# EAGLE design mpx4115-breakout (EAGLE 6.5.0)
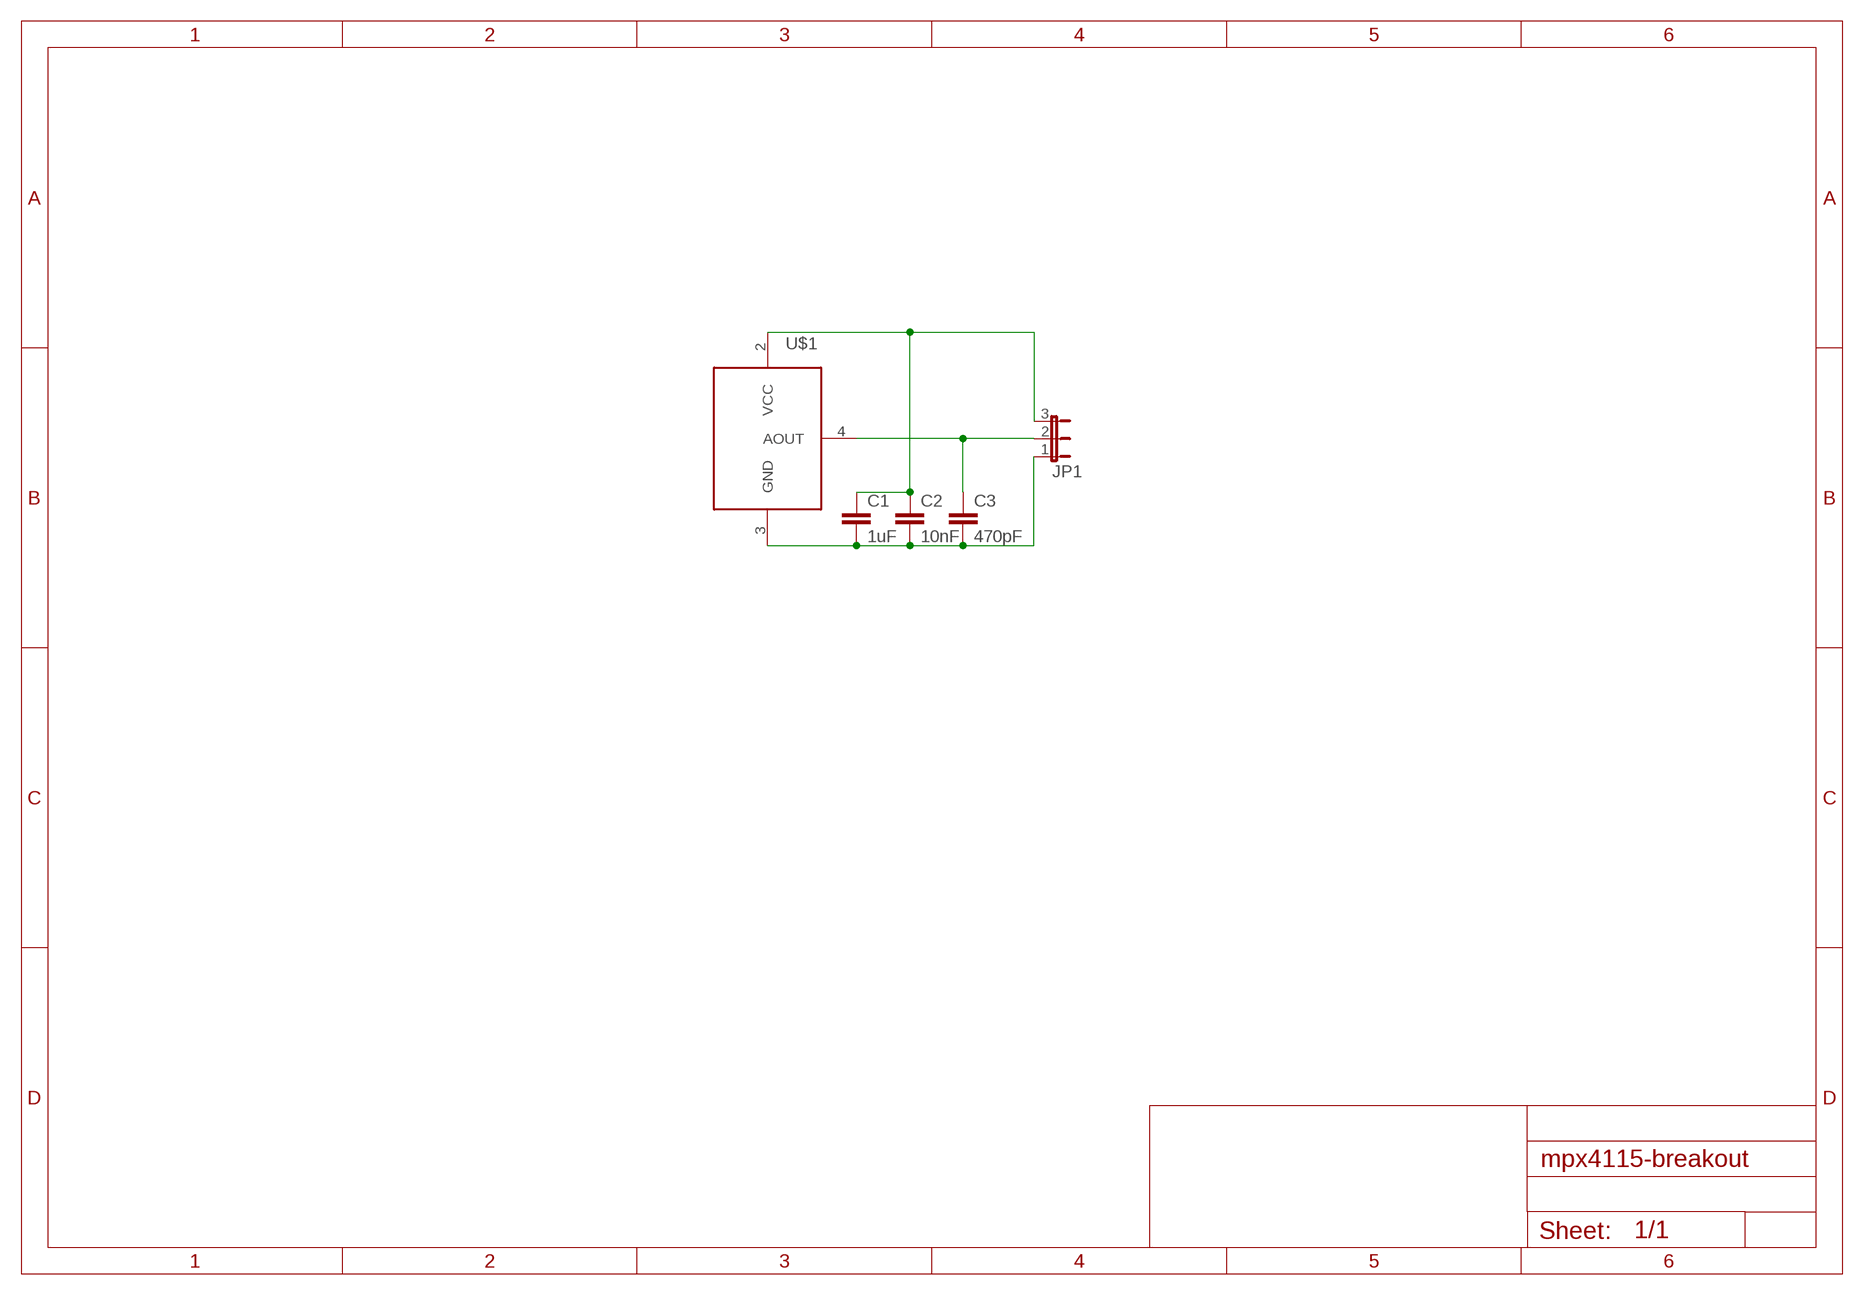
[diagram p0: schematic, sheet 1]

## Parts
C1  1uF  C-EUC0805  [C0805]
C2  10nF  C-EUC0805  [C0805]
C3  470pF  C-EUC0805  [C0805]
JP1  JP2E  [JP2]
U$1  MPX4115A  [MPX4115A]

## Nets
AOUT: C3.1 JP1.2 U$1.4(AOUT)
GND: C1.2 C2.2 C3.2 JP1.1 U$1.3(GND)
VCC: C1.1 C2.1 JP1.3 U$1.2(VCC)

## Library data of the parts
C1-C3 = resistor:C-EU: CAPACITOR, European symbol
JP1 = jumper:JP2E: JUMPER
U$1 = mountainsensing:MPX4115A

## Board
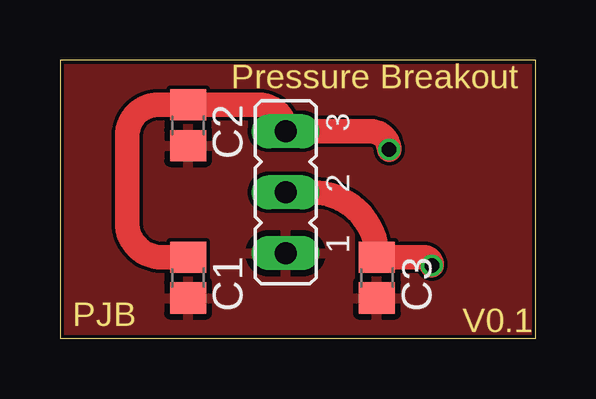
[diagram p1: board, top side]
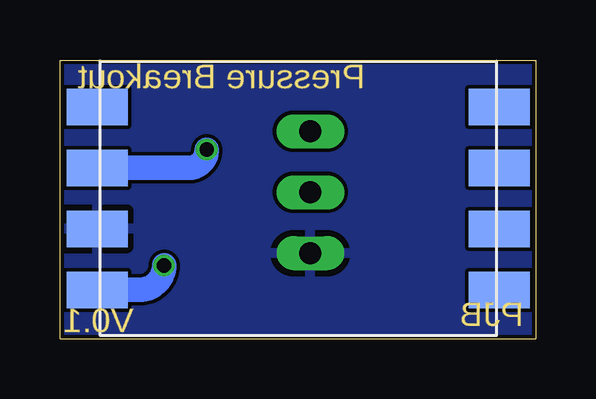
[diagram p2: board, bottom side, seen from below]

Size 19.83 x 11.61 mm. Coordinates in mm from the lower left corner, seen from the top.
Outline: 19.83,0 19.83,11.61 0,11.61 0,0 19.83,0
Copper layers (1*16): Top 0.035mm / dielectric 1.5mm / Bottom 0.035mm
Design rules "Hackvana": minimum track width 6mil, minimum drill 0.3mm, track to track 6mil, track to pad 6mil, pad to pad 6mil, via to via 6mil, smd to smd 0mil, copper to edge 6mil, drill to drill 6mil, minimum pad ring 10mil, minimum via ring 6mil, stop-mask expansion 2mil, vias tented up to drill 100mil, thermal gap 10mil

### Footprints (pad centres in the part's own frame; a part is rotated, then mirrored left to right if it is on the bottom)
C0805 = smd 1.3 x 1.5: 1 -0.85,0; 2 0.85,0
JP2 = drill 0.914 long: 1 -2.54,0; 2 0,0; 3 2.54,0
MPX4115A = smd 2.54 x 1.524: 1 -8.128,4.572; 2 -8.128,2.032; 3 -8.128,-0.508; 4 -8.128,-3.048; 5 8.636,4.572; 6 8.636,2.032; 7 8.636,-0.508; 8 8.636,-3.048

### Placement (x,y rotation side)
C1  5.33,2.54 270 top
C2  5.33,8.89 270 top
C3  13.21,2.54 270 top
JP1  9.4,6.1 90 top
U$1  10.16,5.08 0 bottom

### Tracks (layer width: path | path; a pad name or v marks a point on that pad's centre or on a via)
AOUT  (via drill 0.6)
  Top 1.016: v15.49,3.05 arc90 15.15,3.39 C3.1 arc90 10.5,6.1 JP1.2
  Bottom 1.016: v15.49,3.05 arc90 16.51,2.03 U$1.4
GND
  pour Top: -1.52,13.21 21.34,13.21 21.34,-1.52 -1.52,-1.52
  pour Bottom: -0.76,12.7 20.83,12.7 20.83,-1.02 -0.76,-1.02
VCC  (via drill 0.6)
  Top 1.016: v13.72,7.87 arc90 12.95,8.64 JP1.3 arc90 8.29,9.74 C2.1 arc90 5.32,9.75 4.12,9.75 arc90 2.79,8.43 2.79,4.83 arc90 4.23,3.39 C1.1
  Bottom 1.016: v13.72,7.87 arc90 14.48,7.11 U$1.2

### Text on the board
Dimension: Pressure Breakout | PJB | V0.1